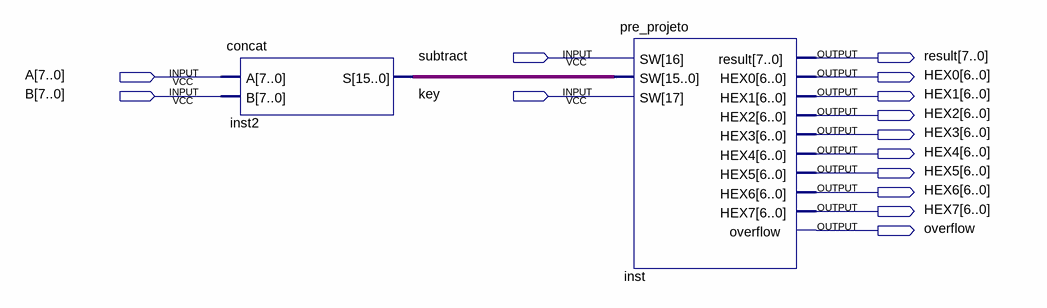
[diagram p0: schematic sheet]
// Quartus schematic calculator.bdf as structural Verilog: 2 symbols, 14 pins
module calculator (
  input  subtract,
  input  [7:0] A,
  input  [7:0] B,
  input  key,
  output [7:0] result,
  output [6:0] HEX0,
  output [6:0] HEX1,
  output [6:0] HEX2,
  output [6:0] HEX3,
  output [6:0] HEX4,
  output [6:0] HEX5,
  output [6:0] HEX6,
  output [6:0] HEX7,
  output overflow
);

  wire [15:0] inst2_s;

  concat inst2 (.A(A), .B(B), .S(inst2_s));
  pre_projeto inst (
    .SW({key, subtract, inst2_s}), .result(result), .HEX0(HEX0), .HEX1(HEX1), .HEX2(HEX2), .HEX3(HEX3),
    .HEX4(HEX4), .HEX5(HEX5), .HEX6(HEX6), .HEX7(HEX7), .overflow(overflow));
endmodule
